# Altium schematic sheet adapter.SchDoc
size A4
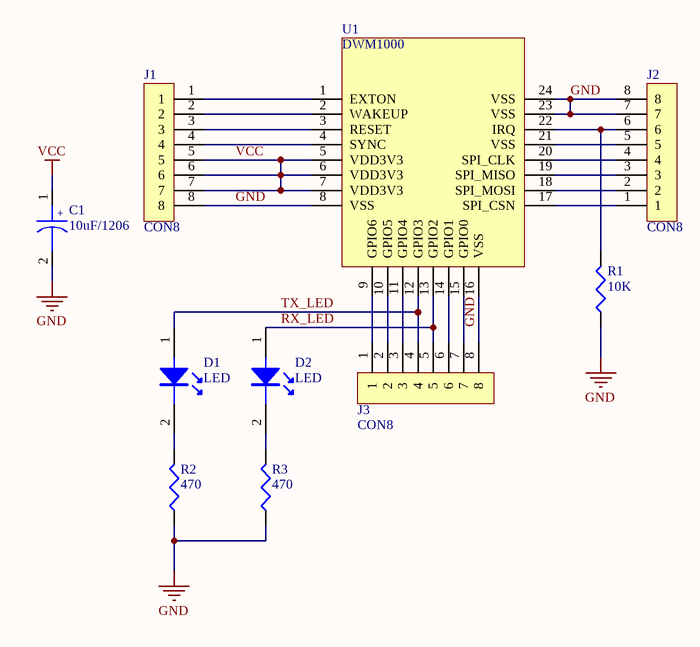
[diagram p0: adapter.SchDoc]

## Parts
C1  10uF/1206  [C1206]
D1  LED  [LED0805]
D2  LED  [LED0805]
J1  CON8  [HDR1X8]
J2  CON8  [HDR1X8]
J3  CON8  [HDR1X8]
R1  10K  [R0603]
R2  470  [R0603]
R3  470  [R0603]
U1  DWM1000  [DWM1000_MODULE]

## Nets
GND: C1.2 J1.8 J2.7 J2.8 J3.8 R1.1 R2.1 R3.1 U1.8(VSS) U1.16(VSS) U1.23(VSS) U1.24(VSS)
VCC: C1.1 J1.5 J1.6 J1.7 U1.5(VDD3V3) U1.6(VDD3V3) U1.7(VDD3V3)
RX_LED: D2.1(A) J3.5 U1.13(GPIO2)
TX_LED: D1.1(A) J3.4 U1.12(GPIO3)
NetD1_2: D1.2(K) R2.2
NetD2_2: D2.2(K) R3.2
NetJ1_1: J1.1 U1.1(EXTON)
NetJ1_2: J1.2 U1.2(WAKEUP)
NetJ1_3: J1.3 U1.3(RESET)
NetJ1_4: J1.4 U1.4(SYNC)
NetJ2_1: J2.1 U1.17(SPI_CSN)
NetJ2_2: J2.2 U1.18(SPI_MOSI)
NetJ2_3: J2.3 U1.19(SPI_MISO)
NetJ2_4: J2.4 U1.20(SPI_CLK)
NetJ2_5: J2.5 U1.21(VSS)
NetJ2_6: J2.6 R1.2 U1.22(IRQ)
NetJ3_1: J3.1 U1.9(GPIO6)
NetJ3_2: J3.2 U1.10(GPIO5)
NetJ3_3: J3.3 U1.11(GPIO4)
NetJ3_6: J3.6 U1.14(GPIO1)
NetJ3_7: J3.7 U1.15(GPIO0)

## Notes on the sheet
- (in symbol CAP) +

## Library data of the parts
C1 = CAP: Capacitor
R1-R3 = RES
U1 = DWM1000_MODULE